# Altium schematic sheet Power Supply.SchDoc
size A4
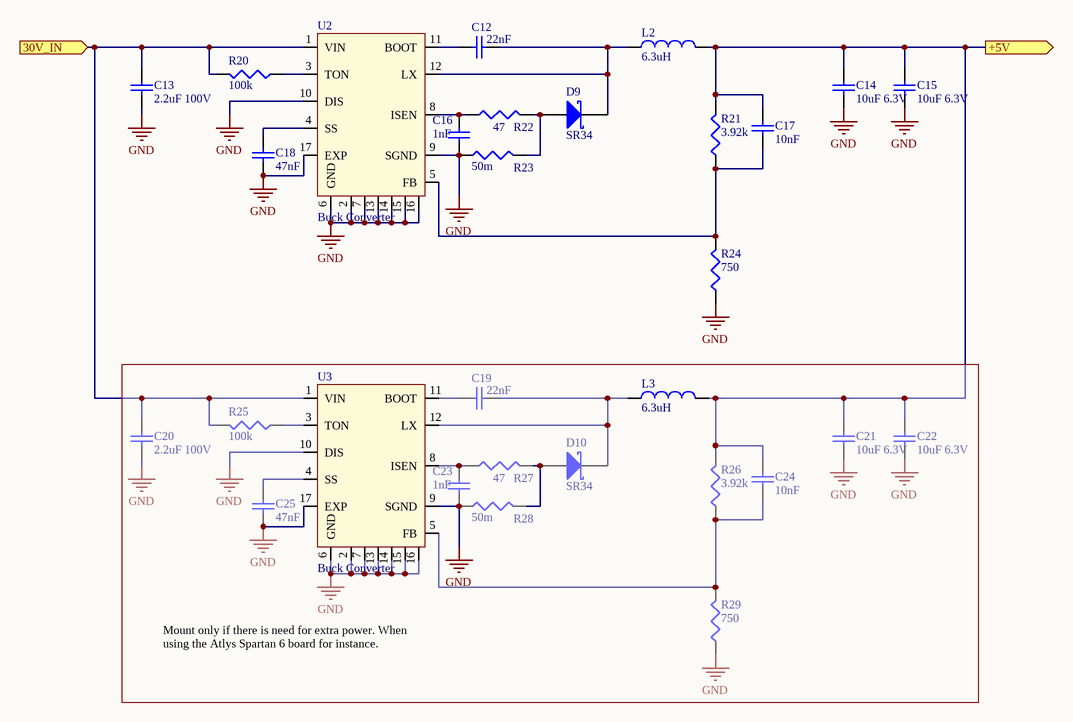
[diagram p0: Power Supply.SchDoc]

## Parts
C12  value 22nF  [6-0805_N]  (hidden comment: Cap Semi)
C13  value 2.2uF 100V  [C1210]  (hidden comment: Cap Semi)
C14  value 10uF 6.3V  [6-0805_N]  (hidden comment: Cap Semi)
C15  value 10uF 6.3V  [6-0805_N]  (hidden comment: Cap Semi)
C16  value 1nF  [6-0805_N]  (hidden comment: Cap Semi)
C17  value 10nF  [6-0805_N]  (hidden comment: Cap Semi)
C18  value 47nF  [6-0805_N]  (hidden comment: Cap Semi)
C19  value 22nF  [6-0805_N]  (hidden comment: Cap Semi)
C20  value 2.2uF 100V  [C1210]  (hidden comment: Cap Semi)
C21  value 10uF 6.3V  [6-0805_N]  (hidden comment: Cap Semi)
C22  value 10uF 6.3V  [6-0805_N]  (hidden comment: Cap Semi)
C23  value 1nF  [6-0805_N]  (hidden comment: Cap Semi)
C24  value 10nF  [6-0805_N]  (hidden comment: Cap Semi)
C25  value 47nF  [6-0805_N]  (hidden comment: Cap Semi)
D9  SR34  [CD4532-1812]
D10  SR34  [CD4532-1812]
L2  6.3uH  [WE_74477006]
L3  6.3uH  [WE_74477006]
R20  value 100k  [6-0805_L]  (hidden comment: Res3)
R21  value 3.92k  [6-0805_L]  (hidden comment: Res3)
R22  value 47  [6-0805_L]  (hidden comment: Res3)
R23  value 50m  [6-0805_L]  (hidden comment: Res3)
R24  value 750  [6-0805_L]  (hidden comment: Res3)
R25  value 100k  [6-0805_L]  (hidden comment: Res3)
R26  value 3.92k  [6-0805_L]  (hidden comment: Res3)
R27  value 47  [6-0805_L]  (hidden comment: Res3)
R28  value 50m  [6-0805_L]  (hidden comment: Res3)
R29  value 750  [6-0805_L]  (hidden comment: Res3)
U2  Buck Converter  [QFN65P400X400X80-16N]
U3  Buck Converter  [QFN65P400X400X80-16N]

## Ports
30V_IN (in), +5V (out)

## Nets
GND: C13.1 C14.1 C15.1 C16.1 C18.1 C20.1 C21.1 C22.1 C23.1 C25.1 R23.1 R24.1 R28.1 R29.1 U2.2 U2.6(GND) U2.7 U2.9(SGND) U2.10(DIS) U2.13 U2.14 U2.15 U2.16 U2.17(EXP) U3.2 U3.6(GND) U3.7 U3.9(SGND) U3.10(DIS) U3.13 U3.14 U3.15 U3.16 U3.17(EXP)
30V_IN: C13.2 C20.2 R20.2 R25.2 U2.1(VIN) U3.1(VIN) ; port 30V_IN
+5V: C14.2 C15.2 C17.2 C21.2 C22.2 C24.2 L2.2 L3.2 R21.2 R26.2 ; port +5V
NetC12_1: C12.1 D9.2(K) L2.1 U2.12(LX)
NetC12_2: C12.2 U2.11(BOOT)
NetC16_2: C16.2 R22.1 U2.8(ISEN)
NetC17_1: C17.1 R21.1 R24.2 U2.5(FB)
NetC18_2: C18.2 U2.4(SS)
NetC19_1: C19.1 D10.2(K) L3.1 U3.12(LX)
NetC19_2: C19.2 U3.11(BOOT)
NetC23_2: C23.2 R27.1 U3.8(ISEN)
NetC24_1: C24.1 R26.1 R29.2 U3.5(FB)
NetC25_2: C25.2 U3.4(SS)
NetD9_1: D9.1(A) R22.2 R23.2
NetD10_1: D10.1(A) R27.2 R28.2
NetR20_1: R20.1 U2.3(TON)
NetR25_1: R25.1 U3.3(TON)

## Notes on the sheet
- Mount only if there is need for extra power. When using the Atlys Spartan 6 board for instance.

## Library data of the parts
C12-C25 = Cap Semi: Capacitor (Semiconductor SIM Model); Published: 8-Jun-2000; LatestRevisionDate: 29-May-2009; LatestRevisionNote: IPC-7351 Footprint Added.; PackageReference: C1206; Publisher: Altium Limited; PackageDescription: Chip Capacitor
D9 D10 = D Schottky: Schottky Diode; Published: 8-Jun-2000; LatestRevisionDate: 17-Jul-2002; LatestRevisionNote: Re-released for DXP Platform.; PackageReference: SMB; Publisher: Altium Limited; PackageDescription: DO-214-AA/SMB; 2 C-Bend Leads; Body 5.3 x 3.6 mm, inc. leads (LxW); Code_JEDEC: DO-214-AA
L2 L3 = Inductor: Header, 3-Pin; LatestRevisionDate: 17-Jul-2002; LatestRevisionNote: Re-released for DXP Platform.; Publisher: Altium Limited; Value: 6.3uH
R20-R29 = Res3: Resistor; Published: 8-Jun-2000; LatestRevisionDate: 29-May-2009; LatestRevisionNote: IPC-7351 Footprint Added.; PackageReference: J1-0603; Publisher: Altium Limited; PackageDescription: Chip Resistor
U2 U3 = A4403 Buck Converter: Header, 3-Pin; LatestRevisionDate: 17-Jul-2002; LatestRevisionNote: Re-released for DXP Platform.; Publisher: Altium Limited